# Altium project Product_Sorter.PrjPcb
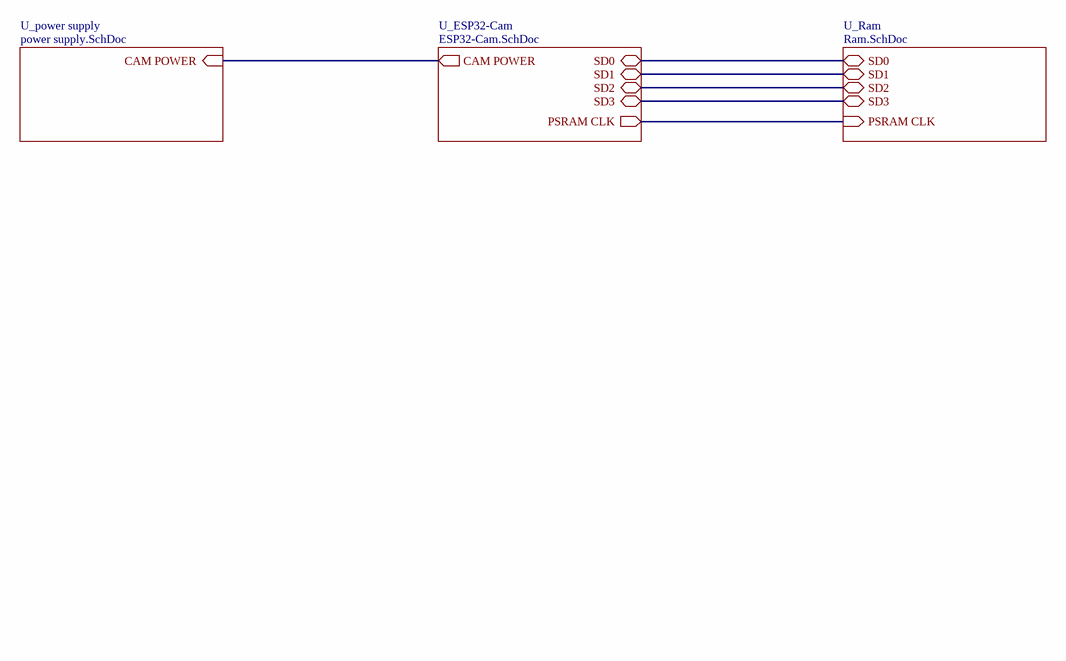
[diagram p0: Main.SchDoc]
4 sheets, 52 parts. Net scope: hierarchical (ports join the sheet entries above them; power ports are global).
Board file: Product_Sorter.PcbDoc
Sheets:
  Main.SchDoc
    U_ESP32-Cam = ESP32-Cam.SchDoc
    U_power supply = power supply.SchDoc
    U_Ram = Ram.SchDoc

## Sheet Main.SchDoc: Main
size 292 x 203 mm; DrawnBy: DMGB Nawarathna; DocumentNumber: -; Revision: A; SheetNumber: 1; SheetTotal: 4; Project: Product Sorter; DateDrawn: 4/4/2024

### Sub-sheets
U_ESP32-Cam = ESP32-Cam.SchDoc: CAM POWER (out), SD0 (bidir), SD1 (bidir), SD2 (bidir), SD3 (bidir), PSRAM CLK (out)
U_power supply = power supply.SchDoc: CAM POWER (in)
U_Ram = Ram.SchDoc: PSRAM CLK (in), SD1 (bidir), SD0 (bidir), SD3 (bidir), SD2 (bidir)

### Nets
NetM1_8: sheet U_ESP32-Cam/CAM POWER, sheet U_power supply/CAM POWER
NetM1_17: sheet U_ESP32-Cam/SD2, sheet U_Ram/SD2
NetM1_18: sheet U_ESP32-Cam/SD3, sheet U_Ram/SD3
NetM1_21: sheet U_ESP32-Cam/SD0, sheet U_Ram/SD0
NetM1_22: sheet U_ESP32-Cam/SD1, sheet U_Ram/SD1
NetM1_28: sheet U_ESP32-Cam/PSRAM CLK, sheet U_Ram/PSRAM CLK

### Notes on the sheet
- Rev.
- Description
- Revisions
- Date
- Aprvd.
- Title
- SCHEMATIC
- Number
- Drawn
- Chkd.
- Name
- Project
- Sheet      of
- Revision

## Sheet ESP32-Cam.SchDoc: ESP32-CAM
size 292 x 203 mm; DrawnBy: DMGB Nawarathna; DocumentNumber: -; SheetNumber: 2; SheetTotal: 4; Project: Product Sorter; DateDrawn: 4/4/2024
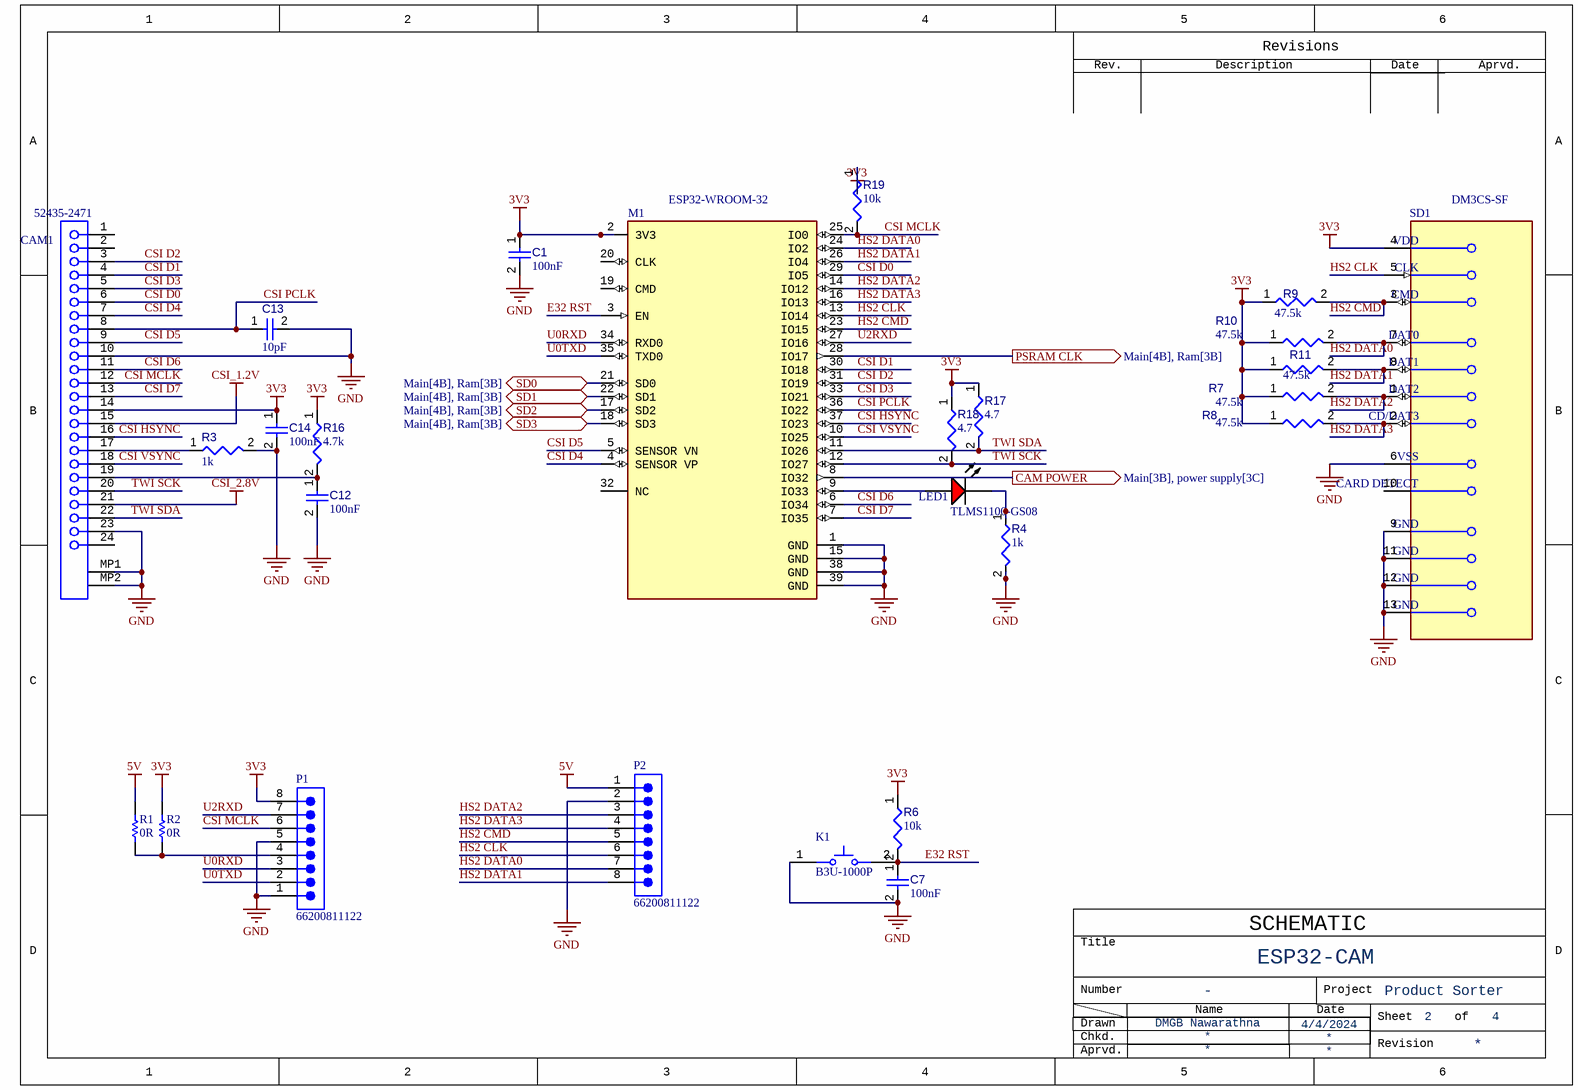
[diagram p1: ESP32-Cam.SchDoc]

### Parts
C1  value 100nF  [CAPC1005X56X25LL10T15]  (hidden comment: Capacitor 0.1 uF +/- 5% 16 V 0402)
C7  value 100nF  [CAPC1005X56X25LL10T15]  (hidden comment: Capacitor 0.1 uF +/- 5% 16 V 0402)
C12  value 100nF  [CAPC1005X56X25LL10T15]  (hidden comment: Capacitor 0.1 uF +/- 5% 16 V 0402)
C13  value 10pF  [CAPC1005X55X25ML05T05]  (hidden comment: Capacitor 10 pF +/- 5% 50 V 0402)
C14  value 100nF  [CAPC1005X56X25LL10T15]  (hidden comment: Capacitor 0.1 uF +/- 5% 16 V 0402)
CAM1  52435-2471  [MOLX-52435-2471]
K1  B3U-1000P  [OMRON-B3U-1000_V]
LED1  TLMS1100-GS08  [VISH-TLMX1100_V]
M1  ESP32-WROOM-32  [FP-ESP32-WROOM-32-MFG]
P1  66200811122  [66200811122]
P2  66200811122  [66200811122]
R1  value 0R  [RESC1005X40X25ML05T10]  (hidden comment: Resistor 0R 0402 63 mW)
R2  value 0R  [RESC1005X40X25ML05T10]  (hidden comment: Resistor 0R 0402 63 mW)
R3  value 1k  [RESC0805(2012)_L]  (hidden comment: Resistor 1K +/-5% 0805 125 mW)
R4  value 1k  [RESC0805(2012)_L]  (hidden comment: Resistor 1K +/-5% 0805 125 mW)
R6  value 10k  [RESC0402(1005)_L]  (hidden comment: Resistor 10K  +/-1 % 0402 63 mW)
R7  value 47.5k  [RESC0402(1005)_L]  (hidden comment: Resistor 47K5 +/-1 % 0402 63 mW)
R8  value 47.5k  [RESC0402(1005)_L]  (hidden comment: Resistor 47K5 +/-1 % 0402 63 mW)
R9  value 47.5k  [RESC0402(1005)_L]  (hidden comment: Resistor 47K5 +/-1 % 0402 63 mW)
R10  value 47.5k  [RESC0402(1005)_L]  (hidden comment: Resistor 47K5 +/-1 % 0402 63 mW)
R11  value 47.5k  [RESC0402(1005)_L]  (hidden comment: Resistor 47K5 +/-1 % 0402 63 mW)
R16  value 4.7k  [RESC1005X40X25ML05T05]  (hidden comment: Resistor 4k7 +/-1% 0402 100 mW)
R17  value 4.7  [RESC0805(2012)_L]  (hidden comment: Resistor 4R7  +/-5 % 0805 125 mW)
R18  value 4.7  [RESC0805(2012)_L]  (hidden comment: Resistor 4R7  +/-5 % 0805 125 mW)
R19  value 10k  [RESC2013X50X35ML15T15]  (hidden comment: Resistor 10k +/-1% 0805 125 mW)
SD1  DM3CS-SF  [FP-DM3CS-SF-MFG]

### Ports
CAM POWER (out, see Main[3B], power supply[3C]), PSRAM CLK (out, see Main[4B], Ram[3B]), SD0 (bidir, see Main[4B], Ram[3B]), SD1 (bidir, see Main[4B], Ram[3B]), SD2 (bidir, see Main[4B], Ram[3B]), SD3 (bidir, see Main[4B], Ram[3B])

### Nets
3V3: C1.1 C14.1 CAM1.14 M1.2(3V3) P1.8 R2.1 R6.1 R7.1 R8.1 R9.1 R10.1 R11.1 R16.1 R17.1 R18.1 R19.1 SD1.4(VDD)
5V: P2.1 R1.1
CSI_1.2V: CAM1.15
CSI_2.8V: CAM1.21
GND: C1.2 C7.2 C12.2 C13.2 C14.2 CAM1.10 CAM1.23 CAM1.MP1 CAM1.MP2 K1.1 M1.1(GND) M1.15(GND) M1.38(GND) M1.39(GND) P1.1 P1.5 P2.2 R3.2 R4.2 SD1.6(VSS) SD1.9(GND) SD1.11(GND) SD1.12(GND) SD1.13(GND)
CSI D0: CAM1.6 M1.29(IO5)
CSI D1: CAM1.4 M1.30(IO18)
CSI D2: CAM1.3 M1.31(IO19)
CSI D3: CAM1.5 M1.33(IO21)
CSI D4: CAM1.7 M1.4(SENSOR_VP)
CSI D5: CAM1.9 M1.5(SENSOR_VN)
CSI D6: CAM1.11 M1.6(IO34)
CSI D7: CAM1.13 M1.7(IO35)
CSI HSYNC: CAM1.16 M1.37(IO23)
CSI MCLK: CAM1.12 M1.25(IO0) P1.6 R19.2
CSI PCLK: C13.1 CAM1.8 M1.36(IO22)
CSI VSYNC: CAM1.18 M1.10(IO25)
E32 RST: C7.1 K1.2 M1.3(EN) R6.2
HS2 CLK: M1.13(IO14) P2.6 SD1.5(CLK)
HS2 CMD: M1.23(IO15) P2.5 R9.2 SD1.3(CMD)
HS2 DATA0: M1.24(IO2) P2.7 R10.2 SD1.7(DAT0)
HS2 DATA1: M1.26(IO4) P2.8 R11.2 SD1.8(DAT1)
HS2 DATA2: M1.14(IO12) P2.3 R7.2 SD1.1(DAT2)
HS2 DATA3: M1.16(IO13) P2.4 R8.2 SD1.2(CD/DAT3)
TWI SCK: CAM1.20 M1.12(IO27) R18.2
TWI SDA: CAM1.22 M1.11(IO26) R17.2
U0RXD: M1.34(RXD0) P1.3
U0TXD: M1.35(TXD0) P1.2
U2RXD: M1.27(IO16) P1.7
NetC12_1: C12.1 CAM1.19 R16.2
NetCAM1_17: CAM1.17 R3.1
NetLED1_1: LED1.1(A) M1.9(IO33)
NetLED1_2: LED1.2(K) R4.1
NetM1_8: M1.8(IO32) ; port CAM POWER
NetM1_17: M1.17(SD2) ; port SD2
NetM1_18: M1.18(SD3) ; port SD3
NetM1_21: M1.21(SD0) ; port SD0
NetM1_22: M1.22(SD1) ; port SD1
NetM1_28: M1.28(IO17) ; port PSRAM CLK
NetP1_4: P1.4 R1.2 R2.2

Not connected (* = marked no-connect by the designer): CAM1 1 2 24; M1 19(CMD) 20(CLK) 32(NC); SD1 10(CARD_DETECT)

### Notes on the sheet
- Rev.
- Description
- Revisions
- Date
- Aprvd.
- Title
- SCHEMATIC
- Number
- Drawn
- Chkd.
- Name
- Project
- Sheet      of
- Revision

### Library data of the parts
C1 C7 C12 C14 = CMP-001-00001-6: Chip Capacitor, 0.1 uF, +/- 5%, 16 V, 0402 (1005 Metric); Capacitor Type: Ceramic; Voltage Rating: 16V; Max Operating Temperature: 125°C; Min Operating Temperature: -55°C; Case/Package: 0402; Mounting Technology: SM; Pins: 2; Tolerance: 5%; RoHS Compliant: True
C13 = CMP-001-00013-6: Chip Capacitor, 10 pF, +/- 5%, 50 V, 0402 (1005 Metric); Capacitor Type: Ceramic; Voltage Rating: 50V; Max Operating Temperature: 125°C; Pins: 2; Mounting Technology: SM; Tolerance: 5%; RoHS Compliant: True; Case/Package: 0402; Min Operating Temperature: -55°C
CAM1 = CMP-1241-00275-1: 0.5 mm Pitch Easy-On(TM) Type FPC Connector, 2.0 mm Mated Height, Right Angle, ZIF, SMT, Top Contact, 24 Circuits, -40 to 85 degC, ELV and RoHS Compliant, Tape and Reel; Manufacturer: Molex; Pitch - Mating Interface: 0.50mm; PCB Locator: No; Current (Max per Contact): 0.5A; PCB Retention: Yes; Circuits (Loaded): 24; Material - Metal: Phosphor Bronze; Material - Plating Termination: Gold; Mated Height: 2.00mm; Entry Angle: 90degrees Angle; Durability (mating cycles max): 20; Voltage (Max): 50V AC (RMS)/DC; PartNumber: 52435-2471; ComponentLink1Description: Manufacturer URL; Polarized to PCB: Yes; Contact Position: Top; RoHS: TRUE; ComponentLink3Description: Package Specification; Mounting Technology: Surface Mount; ComponentLink2URL: http://www.molex.com/webdocs/datasheets/pdf/en-us/0524352471_FFC_FPC_CONNECTORS.pdf; PackageDescription: 24-Lead FPC Connector, Pitch 0.5 mm; Packing: Tape and Reel; ComponentLink1URL: http://www.molex.com/molex/index.jsp; PackageVersion: Rev. D, 07/2010; ComponentLink3URL: http://www.molex.com/pdm_docs/sd/524352471_sd.pdf; Stackable: No; PackageReference: 52435-2471; Number of Rows: 1; ComponentLink2Description: Datasheet; Orientation: Right Angle; Material - Plating Mating: Gold
K1 = CMP-011-00000-2: Tactile Switch, SPST-NO, 0.05 A, 12 V, -25 to 70 degC, 2-Pin SMD, RoHS, Tape and Reel; Manufacturer: Omron Electronic Components; IP Rating: IP40; Current Rating: 50mA; Max Contact Resistance: 100mohm; Operating Force: 153gf; Throw Configuration: SPST; Resistance: 0.1Ohm; Max Voltage Rating (DC): 12V; Contact Material: Silver; Max Current Rating: 50mA; Datasheet URL: http://www.omron.com/ecb/products/pdf/en-b3u.pdf; Mounting Technology: SM; Case/Package: B3U-1000; Packaging: TapeandReel; Package Reference: B3U-1000; Manufacturer URL: http://www.omron.com/; Datasheet Version: Jan-15; RoHS Compliant: True; Max Operating Temperature: 70°C; Contact Current Rating: 50mA; Package Quantity: 3500; Package Description: 2-Pin Surface Mount Device, Body 3 x 2.5 mm; Voltage Rating (DC): 12V; Min Operating Temperature: -25°C; Voltage Rating: 12V
LED1 = CMP-007-00030-2: Red Led, 20mA, 2.1 V, -40 to 100 degC, 2-Pin SMD (0603), RoHS, Tape and Reel; Manufacturer: Vishay Semiconductor; Viewing Angle: 160degrees; Forward Voltage: 2.1V; Lens Style: Clear; Power: 90mW; Luminous Intensity: 63mcd; Datasheet Version: Rev. 2.7, 03/2016; Package Quantity: 3000; Colour: Red; Package Description: 2-Pin Surface Mount Device, Body 1.6 x 0.8 mm; Datasheet URL: http://www.vishay.com/docs/83173/tlmb1100.pdf; Package Reference: TLMX1100; Max Operating Temperature: 100°C; Mounting Technology: SM; Packaging: TapeandReel; Case/Package: 0603; Illumination Colour: Red; Forward Current: 20mA; Manufacturer URL: http://www.vishay.com/; RoHS Compliant: True; Min Operating Temperature: -40°C; Nominal Vf: 2.1V; Pins: 2
M1 = CMP-194065-000008-1: RX TXRX MOD WIFI SURFACE MOUNT; Frequency: 2.5GHz; Sensitivity: -98dBm; Operating Supply Voltage: 3.6V; Data Rate: 150Mbps; Weight: 0.088185oz; Package Quantity: 550; Min Operating Temperature: -40°C; Mount: Surface Mount; Max Operating Temperature: 85°C; Packaging: Cut Tape; Case/Package: SMD/SMT
P1 P2 = CMP-1502-00446-2: NexarPartId: 23024701; Pitch: 3mm; Number of Contacts: 8; Insulation Resistance: 1GΩ; Connector Type: Male Pin, Socket; Contact Resistance: 10mΩ; Gender: Male; Current Rating: 5A; Operating Supply Voltage: 250V; Height: 11mm; Max Operating Temperature: 105°C; Mount: Through Hole; Orientation: Vertical; Fastening Type: Ramp; Number of Positions: 8; Lead Pitch: 3mm; Number of Rows: 1; RoHS: Compliant; Termination: Kinked Pin; Width: 27.65mm; Contact Material: Copper; REACH SVHC: Unknown; Contact Plating: Tin; Length: 27.65mm; Color: Black; Min Operating Temperature: -40°C; Number of Pins: 8
R1 R2 = CMP-009-00004-5: Chip Resistor, 0 Ohm, 0.063 W, -55 to 155 degC, 0402 (1005 Metric); Power: 63mW; Voltage Rating: 50V; Max Operating Temperature: 155°C; Pins: 2; RoHS Compliant: True; Min Operating Temperature: -55°C; Mounting Technology: SM; Case/Package: 0402
R3 R4 = CMP-009-00118-3: Chip Resistor, 1 kOhms, +/-5%, 125 mW, -55 to 155 degC, 0805; Tolerance: 5%; Power: 125mW; Case/Package: 0805; Pins: 2; Min Operating Temperature: -55°C; Max Operating Temperature: 155°C
R6 = CMP-009-00149-3: Chip Resistor, 10 kOhms, +/-1 %, 63 mW, -55 to 125 degC, 0402; Power: 63mW; Tolerance: 1%; Min Operating Temperature: -55°C; Case/Package: 0402; Max Operating Temperature: 155°C; Pins: 2
R7-R11 = CMP-009-00137-3: Chip Resistor, 47,5 kOhms, +/-1 %, 63 mW, -55 to 155 degC, 0402; Power: 63mW; Tolerance: 1%; Pins: 2; Case/Package: 0402; Min Operating Temperature: -55°C; Max Operating Temperature: 155°C
R16 = CMP-009-00030-5: Chip Resistor, 4.7 KOhm, +/- 1%, 0.1 W, -55 to 155 degC, 0402 (1005 Metric); Power: 100mW; Voltage Rating: 50V; Mounting Technology: SM; RoHS Compliant: True; Tolerance: 1%; Min Operating Temperature: -55°C; Max Operating Temperature: 155°C; Case/Package: 0402; Pins: 2
R17 R18 = CMP-009-00174-3: Chip Resistor, 4,7 Ohms, +/-5 %, 125 mW, -55 to 155 degC, 0805; Tolerance: 5%; Power: 125mW; Max Operating Temperature: 155°C; Case/Package: 0805; Min Operating Temperature: -55°C; Pins: 2
R19 = CMP-009-00018-5: Chip Resistor, 10 KOhm, +/- 1%, 125 mW, -55 to 155 degC, 0805 (2012 Metric); Power: 125mW; Voltage Rating: 150V; Tolerance: 1%; Pins: 2; Min Operating Temperature: -55°C; Case/Package: 0805; Max Operating Temperature: 155°C; RoHS Compliant: True; Mounting Technology: SM
SD1 = CMP-11597-000003-1: CONN MICRO SD CARD HINGED TYPE; Pitch: 1.1mm; Connector Type: Connector; Current Rating: 500mA; Voltage Rating (AC): 125V; Gender: Female; Insulation Resistance: 1GR; Number of Positions: 8; Contact Resistance: 100mR; Packaging: Tape and Reel; Flammability Rating: UL94 V-0; Lead Free: Lead Free; Min Operating Temperature: -25°C; Orientation: Right Angle; Width: 13.8mm; Number of Rows: 1; Housing Material: Polymer; Package Quantity: 1; Mount: Surface Mount; Max Current Rating: 500mA; Radiation Hardening: No; Max Operating Temperature: 85°C; Contact Plating: Gold; Depth: 1.83mm; Contact Material: Gold; Length: 14.1mm; Number of Contacts: 8; Termination: Solder

## Sheet power supply.SchDoc: Power Supply
size 292 x 203 mm; DrawnBy: DMGB Nawarathna; DocumentNumber: -; SheetNumber: 3; SheetTotal: 4; Project: Product Sorter; DateDrawn: 4/4/2024
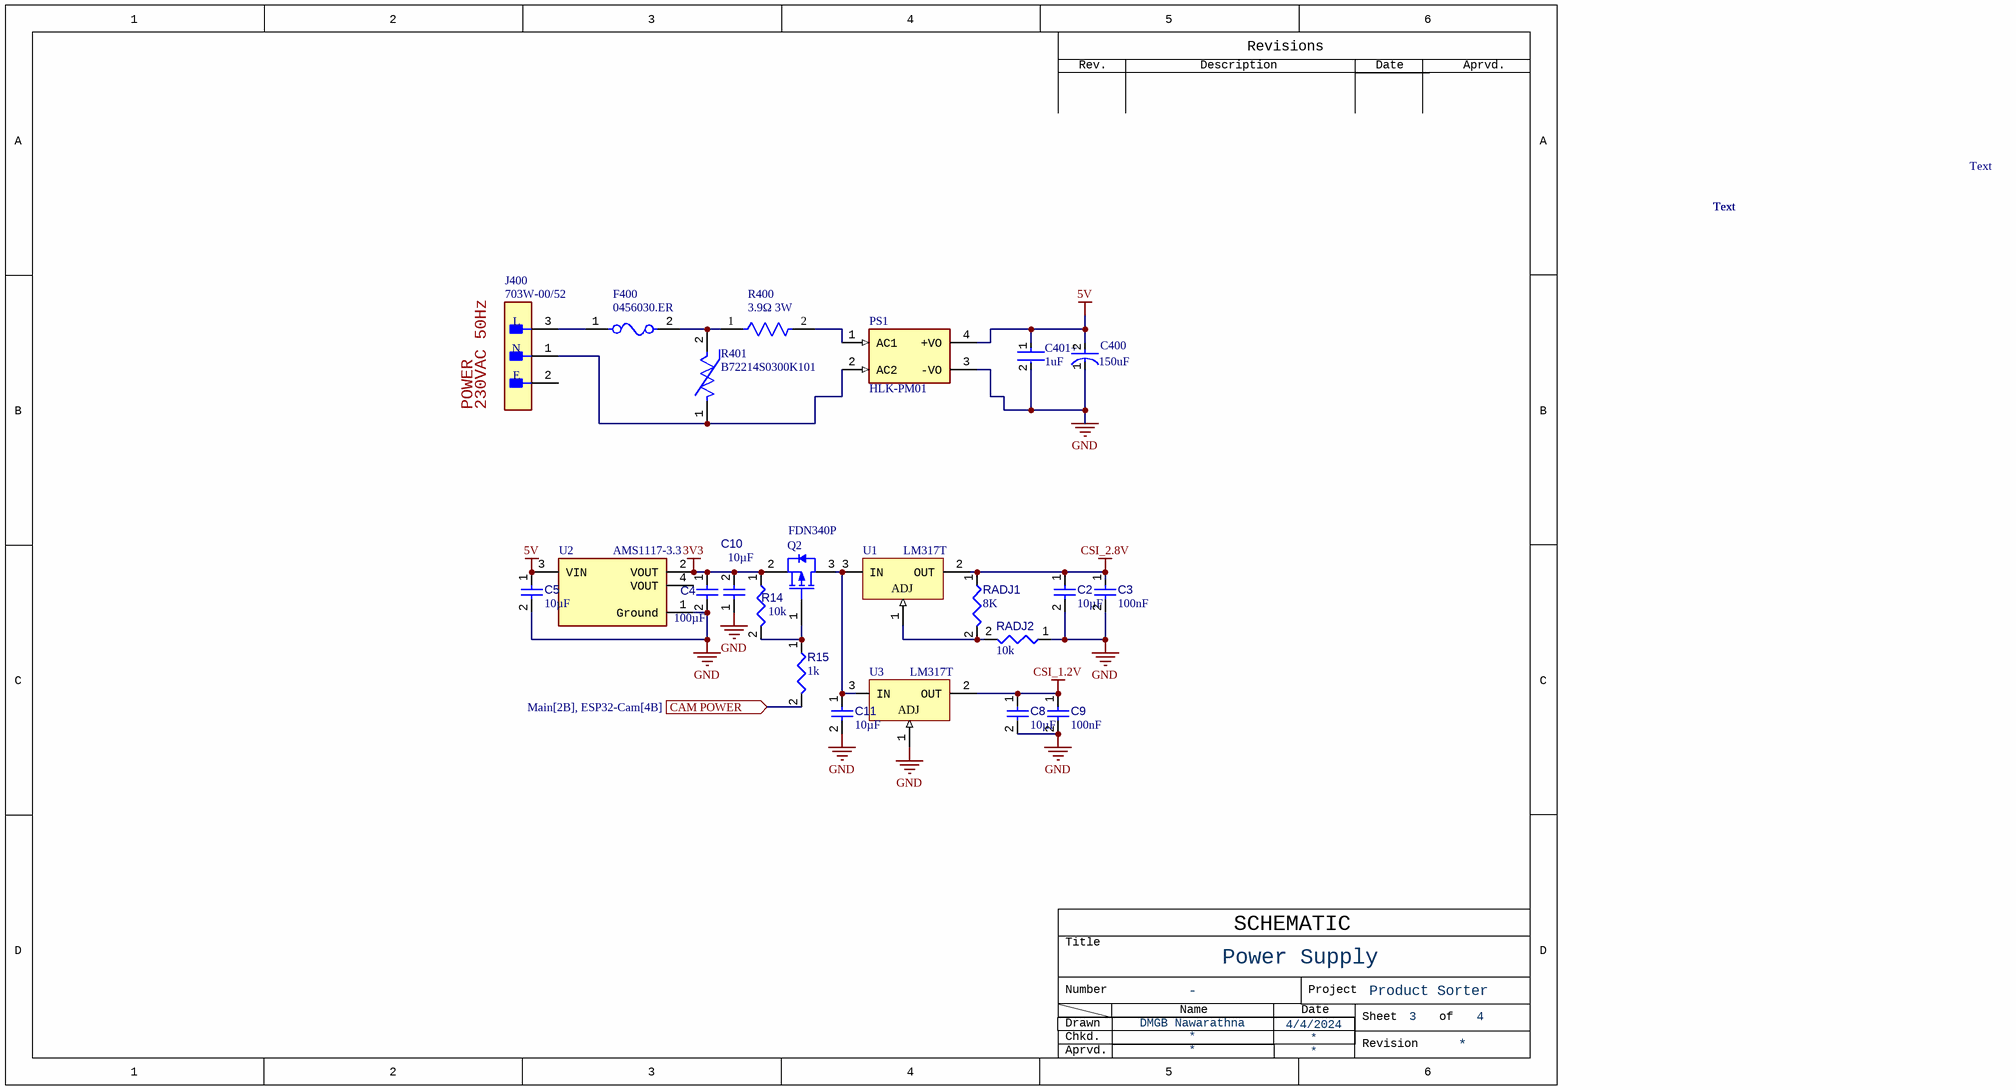
[diagram p2: power supply.SchDoc]

### Parts
C2  value 10µF  [CAPC0603(1608)100_L]  (hidden comment: Capacitor 10µF +/-20% 10V 0603)
C3  value 100nF  [CAPC1005X56X25LL10T15]  (hidden comment: Capacitor 0.1 uF +/- 5% 16 V 0402)
C4  value 100µF  [CAPC0805(2012)145_L]  (hidden comment: Capacitor 100µF +/-20% 6.3V 0805)
C5  value 10µF  [CAPC0603(1608)100_L]  (hidden comment: Capacitor 10µF +/-20% 10V 0603)
C8  value 10µF  [CAPC0603(1608)100_L]  (hidden comment: Capacitor 10µF +/-20% 10V 0603)
C9  value 100nF  [CAPC1005X56X25LL10T15]  (hidden comment: Capacitor 0.1 uF +/- 5% 16 V 0402)
C10  value 10µF  [CAPC0603(1608)100_L]  (hidden comment: Capacitor 10µF +/-20% 10V 0603)
C11  value 10µF  [CAPC0603(1608)100_L]  (hidden comment: Capacitor 10µF +/-20% 10V 0603)
C400  Capacitance: 150uF  [FP-FKD-MFG]  (hidden comment: EEE-FK1A151P)
C401  Capacitance: 1uF  [FP-1210-L_3_3_0_4-W_2_5_0-IPC_B]  (hidden comment: 12101C105KAZ2A)
F400  0456030.ER  [FP-0456-MFG]
J400  703W-00/52  [FP-703W-00-52-MFG]
PS1  HLK-PM01  [CONV_HLK-PM01]
Q2  FDN340P  [FAIR-SSOT3L-3_V]
R14  value 10k  [RESC2013X50X35ML15T15]  (hidden comment: Resistor 10k +/-1% 0805 125 mW)
R15  value 1k  [RESC0805(2012)_L]  (hidden comment: Resistor 1K +/-5% 0805 125 mW)
R400  Power Rating: 3W  Resistance: 3.9Ω  [FP-RWM0410-MFG]  (hidden comment: RWM04103R90JR15E1)
R401  B72214S0300K101  [FP-B72214S0300K101-MFG]
RADJ1  value 8K  [RESC0805(2012)_L]  (hidden comment: Resistor 1K +/-5% 0805 125 mW)
RADJ2  value 10k  [RESC2013X50X35ML15T15]  (hidden comment: Resistor 10k +/-1% 0805 125 mW)
U1  LM317T  [TO-220]
U2  AMS1117-3.3  [FP-AMS1117-IPC_C]
U3  LM317T  [TO-220]

### Ports
CAM POWER (in, see Main[2B], ESP32-Cam[4B])

### Nets
3V3: C4.1 C10.2 Q2.2(SOURCE) R14.1 U2.2(VOUT)
5V: C5.1 C400.2(A) C401.1 PS1.4(+VO) U2.3(VIN)
CSI_1.2V: C8.1 C9.1 U3.2(OUT)
CSI_2.8V: C2.1 C3.1 RADJ1.1 U1.2(OUT)
GND: C2.2 C3.2 C4.2 C5.2 C8.2 C9.2 C10.1 C11.2 C400.1(C) C401.2 PS1.3(-VO) RADJ2.1 U2.1(Ground) U3.1(ADJ)
NetC11_1: C11.1 Q2.3(DRAIN) U1.3(IN) U3.3(IN)
NetF400_1: F400.1 J400.3(L)
NetF400_2: F400.2 R400.1 R401.2
NetJ400_1: J400.1(N) PS1.2(AC2) R401.1
NetM1_8: R15.2 ; port CAM POWER
NetPS1_1: PS1.1(AC1) R400.2
NetQ2_1: Q2.1(GATE) R14.2 R15.1
NetRADJ1_2: RADJ1.2 RADJ2.2 U1.1(ADJ)

Not connected (* = marked no-connect by the designer): J400 2(E); U2 4(VOUT)

### Notes on the sheet
- Text
- POWER
- (near J400) 230VAC 50Hz
- Rev.
- Description
- Revisions
- Date
- Aprvd.
- Title
- SCHEMATIC
- Number
- Drawn
- Chkd.
- Name
- Project
- Sheet      of
- Revision
- (in symbol CMP-05427-002136-1) +

### Library data of the parts
C2 C5 C8 C10 C11 = CMP-001-00075-4: Chip Capacitor, 10µF +/-20%, 10V, 0603, Thickness 1 mm; Tolerance: 10%; Voltage Rating: 10V; Max Operating Temperature: 85°C; Pins: 2; Case/Package: 0603; Mounting Technology: SMT; Min Operating Temperature: -55°C
C3 C9 = CMP-001-00001-6: as C1 on sheet ESP32-Cam; Max Operating Temperature: 125°C; Min Operating Temperature: -55°C; Case/Package: 0402; Mounting Technology: SM; Pins: 2; Tolerance: 5%; RoHS Compliant: True
C4 = CMP-001-00054-4: Chip Capacitor, 100µF +/-20%, 6.3V, 0805, Thickness 1.45 mm; Tolerance: 10%; Min Operating Temperature: -55°C; Max Operating Temperature: 85°C; Pins: 2; Mounting Technology: SMT; Case/Package: 0805; Voltage Rating: 6.3V
C400 = CMP-05427-002136-1: CAP ALUM 150UF 20% 10V SMD; Impedance: 360mR; Ripple Current (AC): 240mA; Polarity: Polar; Life (Hours): 2000Hour; Leakage Current: 3uA; Lead Diameter: 0.65mm; Min Operating Temperature: -55°C; Lead Pitch: 1.8mm; Size: 5.8mm; Diameter: 6.3mm; Package Quantity: 1000; Number of Pins: 2; Termination: SMD/SMT; Mount: Surface Mount; Construction: Cylindrical; Series: FK; Case/Package: Radial; Lead Free: Lead Free; Voltage: 10V; Packaging: Tape and Reel; Height: 5.8mm; Max Operating Temperature: 105°C; Voltage Rating (DC): 10V; Reach SVHC Compliant: Yes; Width: 7.8mm; Tolerance: 20%; Contact Plating: Tin; Voltage Rating: 10V; Ratings: AEC-Q200; RoHS Compliant: Yes; Radiation Hardening: No; ESR (Equivalent Series Resistance): 360mR; Height - Seated (Max): 0.24inch; Length: 5.8mm; Ripple Current: 240mA
C401 = CMP-04427-007938-1: General Purpose Ceramic Capacitor, 1210, 1uF, 10%, X7R, 15%, 100V; Dissipation Factor: 2.5%; Package Quantity: 1; Contact Plating: Tin; Lead Free: Lead Free; Construction: Flat; Dielectric: X7R; Width: 2.5mm; Voltage Rating (DC): 100V; Case Code (Imperial): 1210; Case Code (Metric): 3225; Packaging: Tape and Reel; Min Operating Temperature: -55°C; Tolerance: 10%; Voltage: 100V; RoHS Compliant: Yes; Voltage Rating: 100V; Max Operating Temperature: 125°C; REACH SVHC: No SVHC; Features: Soft Termination; Height: 2.79mm; Termination: SMD/SMT; Thickness: 0.11inch; Case/Package: 1210; Length: 3.2mm; Series: FLEXITERM®; Dielectric Material: Ceramic; Mount: Surface Mount; Radiation Hardening: No; Depth: 2.5mm
F400 = CMP-2000-05709-2: FUSE BOARD MNT 30A 125VAC 72VDC; Manufacturer: Littelfuse; Fuse Interrupt Ac Current: 300A; Fuse Blow Speed: Fast; Voltage Rating: 125V; Max Fuse Dc Voltage: 72V; Fuse Interrupt Dc Current: 1000A; Resistance: 0.00132Ω; Value: 0.00132Ω; Fuse I2T: 81A2Sec; Fuse Voltage Drop: 69.9mV; Package: 0456; Digikey Description: FUSE BOARD MNT 30A 125VAC 72VDC; Mouser Description: 456 Series Fast-Acting 125 V 30 A 10.10 x 3.05 mm NANO2® SMT Ceramic Fuse; Height: 3.05mm; Temperature: -55°C to +125°C; Fuse Current: 30A; Octopart: https://octopart.com/0456030.er-littelfuse-7502597; Ipc Land Pattern Name: CAPC1008305X305; Device Class L3: unset; ComponentLink2URL: https://www.littelfuse.com/~/media/electronics/datasheets/fuses/littelfuse_fuse_456_datasheet.pdf.pdf; Automotive: No; Lead Free: Yes; Device Class L1: Circuit Protection; Temperature Range Low: -55°C; Category: Fuse; Max Fuse Ac Voltage: 125V; Temperature Range High: +125°C; RoHS: TRUE; ComponentLink2Description: Datasheet; Device Class L2: Fuses; Manufacturer Part Number: 0456030.ER
J400 = CMP-64678-000001-1: PWR ENT RCPT IEC320-C14 PNL SLDR; Max Voltage Rating (AC): 250V; Approvals: UL; Current Rating: 15A; Number of Poles: 2; Fuse: No; Number of Positions: 3; Gender: Receptacle; Panel Thickness: 0.12inch; Pitch: 7mm; Voltage Rating (AC): 250V; Orientation: Right Angle; Contact Plating: Tin; Mount: Through Hole; Housing Material: Thermoplastic; Current: 15A; Termination: Solder; REACH SVHC: No SVHC; Lead Free: Lead Free; Voltage Rating: 250V; Number of Contacts: 3; Color: Black; Connector Type: Receptacle; Packaging: Bulk; Max Current Rating: 15A; Voltage Rating (DC): 250V; Package Quantity: 100
PS1 = HLK-PM01: The HLK-PM01 is a small size low cost AC to DC converter which can take in 110V/220V AC at 50/60 Hz and give 5V 3W output. The module is can be used in designs which run on 5V and needs to be powered form the AC mains.; MF: Hi-link; Package: None; Price: None; Value: *; SnapEDA_Link: https://www.snapeda.com/parts/hlk-pm01/Hi-link/view-part/?ref=snap; MP: hlk-pm01; Availability: Not in stock; Check_prices: https://www.snapeda.com/parts/hlk-pm01/Hi-link/view-part/?ref=eda
Q2 = CMP-013-00016-4: Single P-Channel, Logic Level, PowerTrench(R) MOSFET, 2 A, 20 V, -55 to 150 degC, 3-Pin SOT-23, RoHS, Tape and Reel; Manufacturer: Fairchild Semiconductor; Package Version: Rev. 3, 05/2015; Nominal Vgs: -800mV; Power: 500mW; Nominal Dual Supply Voltage: -20V; Typical Rise Time: 9ns; Elements: 1; Rds On Max: 70mohm; Input Capacitance: 779pF; Package Reference: SSOT3L; Min Operating Temperature: -55°C; RoHS Compliant: True; Package Description: 3-Pin Small Outline Transistor, Body 2.92 x 1.4 mm, Pitch 0.95 mm; Pins: 3; Datasheet Version: Rev. E1, 02/2007; Mounting Technology: SM; Package Quantity: 3000; Packaging: TapeandReel; Max Operating Temperature: 150°C; Datasheet URL: https://www.fairchildsemi.com/datasheets/FD/FDN340P.pdf; Case/Package: TO-236-3
R14 RADJ2 = CMP-009-00018-5: as R19 on sheet ESP32-Cam; Tolerance: 1%; Pins: 2; Min Operating Temperature: -55°C; Case/Package: 0805; Max Operating Temperature: 155°C; RoHS Compliant: True; Mounting Technology: SM
R15 RADJ1 = CMP-009-00118-3: as R3 on sheet ESP32-Cam; Case/Package: 0805; Pins: 2; Min Operating Temperature: -55°C; Max Operating Temperature: 155°C
R400 = CMP-00030-42636952-1: RWM04103R90JR15E1 Resistor; Wirewound; Res 3.9 Ohms; Pwr-Rtg 3 W; Tol 5%; Axial; Vitreous Enamel; Lead Diameter: 800µm; Voltage Rating: 120V; Temperature Coefficient: 75ppm/°C; REACH SVHC: No SVHC; Military Standard: Not; Tolerance: 5%; Min Operating Temperature: -55°C; Case/Package: Axial; Voltage Rating (AC): 120V; Diameter: 5.5mm; Termination: Axial; Length: 12mm; Width: 5.5mm; Mount: Through Hole; Max Operating Temperature: 350°C; NexarPartId: 42636952; Max Power Dissipation: 3W; Contact Plating: Copper, Silver, Tin; Height: 6.5mm; RoHS: Compliant; Number of Terminations: 2; Voltage Rating (DC): 120V; Composition: Wirewound; Radiation Hardening: No
R401 = CMP-10618-000011-1: VARISTOR 47V 1KA DISC 14MM; Manufacturer: EPCOS; Clamping Current: 10A; Clamping Voltage: 93V; Voltage Tolerance: 10%; Voltage Rating Dc: 38V; Voltage Rating Ac: 30V; Value: 4950pF; Digikey Description: VARISTOR 47V 1KA DISC 14MM; ComponentLink2Description: Datasheet; Temperature: -40°C to +105°C; Category: Res; Device Class L1: Circuit Protection; Octopart: https://octopart.com/b72214s0300k101-epcos-11931390; Package: 0; Mouser Description: Varistors 30volts 1000A; Temperature Range Low: -40°C; Manufacturer Part Number: B72214S0300K101; Device Class L2: Varistors; Height: 18.5mm; Varistor Voltage: 47V; Device Class L3: unset; RoHS: TRUE; Temperature Range High: +105°C; ComponentLink2URL: https://www.tdk-electronics.tdk.com/inf/70/db/var/SIOV_Leaded_StandarD.pdf; Lead Free: Yes; Capacitance: 4950pF; Automotive: No
U1 U3 = CMP-0244-00444-1: 1.5A, 1.2V to 37V Adjustable Voltage Regulator, 3-Pin TO-220; PackageVersion: 2011; ComponentLink1URL: http://www.st.com; ComponentLink2URL: http://www.st.com/internet/com/TECHNICAL_RESOURCES/TECHNICAL_LITERATURE/DATASHEET/CD00000455.pdf; PackageDescription: TO, Thru-Hole, Vertical, Heatsink Mounted; 3 In-Line Leads; Pitch 2.54 mm; PackageReference: TO-220; ComponentLink1Description: Manufacturer URL; ComponentLink3URL: http://www.st.com/internet/com/TECHNICAL_RESOURCES/TECHNICAL_LITERATURE/PACKAGE_INFORMATION/CD00004649.pdf; DatasheetVersion: 1/11/2011; ComponentLink2Description: Datasheet; ComponentLink3Description: Package Specification
U2 = CMP-209535-000001-1: LDO Voltage Regulators 1A, 3.3V; Manufacturer: Advanced Monolithic Systems; Dropout Voltage: 1.1V; Output Type: Fixed; Nominal Supply Current: 5mA; Max Power Dissipation: 1.2W; Max Supply Voltage: 15V; Number Of Outputs: 1; Standoff Height: 0.64mm; Max Junction Temp: +125°C; Height: 1.8mm; Package: AMS1117; Device Class L2: Power Management ICs; ComponentLink2Description: Datasheet; ComponentLink2URL: http://www.advanced-monolithic.com/pdf/ds1117.pdf; Category: IC; RoHS: TRUE; Automotive: No; Device Class L1: Integrated Circuits (ICs); Output Current: 1A; Device Class L3: Voltage Regulators - Linear; Temperature: -40°C to +125°C; Output Voltage: 3.3V; Manufacturer Part Number: AMS1117-3.3; Temperature Range Low: -40°C; Octopart: https://octopart.com/ams1117-3.3-advanced+monolithic+systems-25899300; Lead Free: Yes; Ipc Land Pattern Name: SOT229P700X180-4; Temperature Range High: +125°C

## Sheet Ram.SchDoc: PSRAM
size 292 x 203 mm; DrawnBy: DMGB Nawarathna; DocumentNumber: -; SheetNumber: 4; SheetTotal: 4; Project: Product Sorter; DateDrawn: 4/4/2024
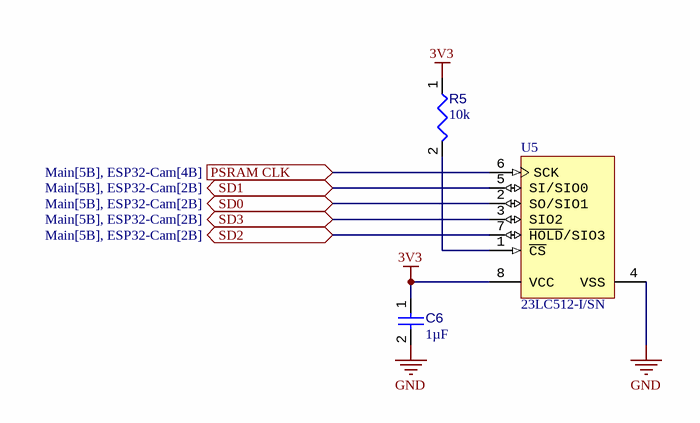
[diagram p3: Ram.SchDoc]

### Parts
C6  value 1µF  [CAPC1608X90X40LL10T20]  (hidden comment: Capacitor 1 uF +/- 10% 25 V 0603)
R5  value 10k  [RESC0402(1005)_L]  (hidden comment: Resistor 10K  +/-1 % 0402 63 mW)
U5  23LC512-I/SN  [MCHP-SOIC-SN8_N]

### Ports
PSRAM CLK (in, see Main[5B], ESP32-Cam[4B]), SD0 (bidir, see Main[5B], ESP32-Cam[2B]), SD1 (bidir, see Main[5B], ESP32-Cam[2B]), SD2 (bidir, see Main[5B], ESP32-Cam[2B]), SD3 (bidir, see Main[5B], ESP32-Cam[2B])

### Nets
3V3: C6.1 R5.1 U5.8(VCC)
GND: C6.2 U5.4(VSS)
NetM1_17: U5.7(~{HOLD}/SIO3) ; port SD2
NetM1_18: U5.3(SIO2) ; port SD3
NetM1_21: U5.2(SO/SIO1) ; port SD0
NetM1_22: U5.5(SI/SIO0) ; port SD1
NetM1_28: U5.6(SCK) ; port PSRAM CLK
NetR5_2: R5.2 U5.1(~{CS})

### Notes on the sheet
- Rev.
- Description
- Revisions
- Date
- Aprvd.
- Title
- SCHEMATIC
- Number
- Drawn
- Chkd.
- Name
- Project
- Sheet      of
- Revision

### Library data of the parts
C6 = CMP-001-00005-6: Chip Capacitor, 1 uF, +/- 10%, 25 V, 0603 (1608 Metric); Capacitor Type: Ceramic; Voltage Rating: 25V; Pins: 2; Mounting Technology: SM; RoHS Compliant: True; Max Operating Temperature: 125°C; Case/Package: 0603; Min Operating Temperature: -55°C; Tolerance: 10%
R5 = CMP-009-00149-3: as R6 on sheet ESP32-Cam; Min Operating Temperature: -55°C; Case/Package: 0402; Max Operating Temperature: 155°C; Pins: 2
U5 = CMP-0163-00041-1: 512K bits SPI Serial SRAM with SDI and SQI Interface, 2.5 to 5.5 V, 20 MHz, -40 to 85 degC, 8-pin SOIC (SN8), Tube; Manufacturer: Microchip; ComponentLink1Description: Manufacturer URL; DatasheetVersion: Rev. A; ComponentLink3Description: Package Specification; ComponentLink2URL: http://ww1.microchip.com/downloads/en/DeviceDoc/25155A.pdf; ComponentLink4Description: Product URL; ComponentLink4URL: http://www.microchip.com/23LC512; PackageReference: SOIC-SN8; PackageVersion: C04-057C; ComponentLink1URL: http://www.microchip.com; ComponentLink2Description: Datasheet; PackageDescription: 8-Lead Plastic Small Outline, 4.9 x 3.9 mm Body, 1.27 mm Pitch; ComponentLink3URL: http://www.microchip.com/stellent/groups/techpub_sg/documents/packagingspec/en012702.pdf; PartNumber: 23LC512-I/SN; Mounting Technology: Surface Mount

## Nets that join several sheets
3V3: ESP32-Cam (17 pins), power supply (5 pins), Ram (C6.1 R5.1 U5.8)
5V: ESP32-Cam (P2.1 R1.1), power supply (5 pins)
CSI_1.2V: ESP32-Cam (CAM1.15), power supply (C8.1 C9.1 U3.2)
CSI_2.8V: ESP32-Cam (CAM1.21), power supply (C2.1 C3.1 RADJ1.1 U1.2)
GND: ESP32-Cam (24 pins), power supply (14 pins), Ram (C6.2 U5.4)
NetM1_8: ESP32-Cam (M1.8), power supply (R15.2)
NetM1_17: ESP32-Cam (M1.17), Ram (U5.7)
NetM1_18: ESP32-Cam (M1.18), Ram (U5.3)
NetM1_21: ESP32-Cam (M1.21), Ram (U5.2)
NetM1_22: ESP32-Cam (M1.22), Ram (U5.5)
NetM1_28: ESP32-Cam (M1.28), Ram (U5.6)